# Altium schematic sheet Lab7-8_CH4.SchDoc
size B; DrawnBy: Aaron Huinink; SheetNumber: 5; SheetTotal: 5
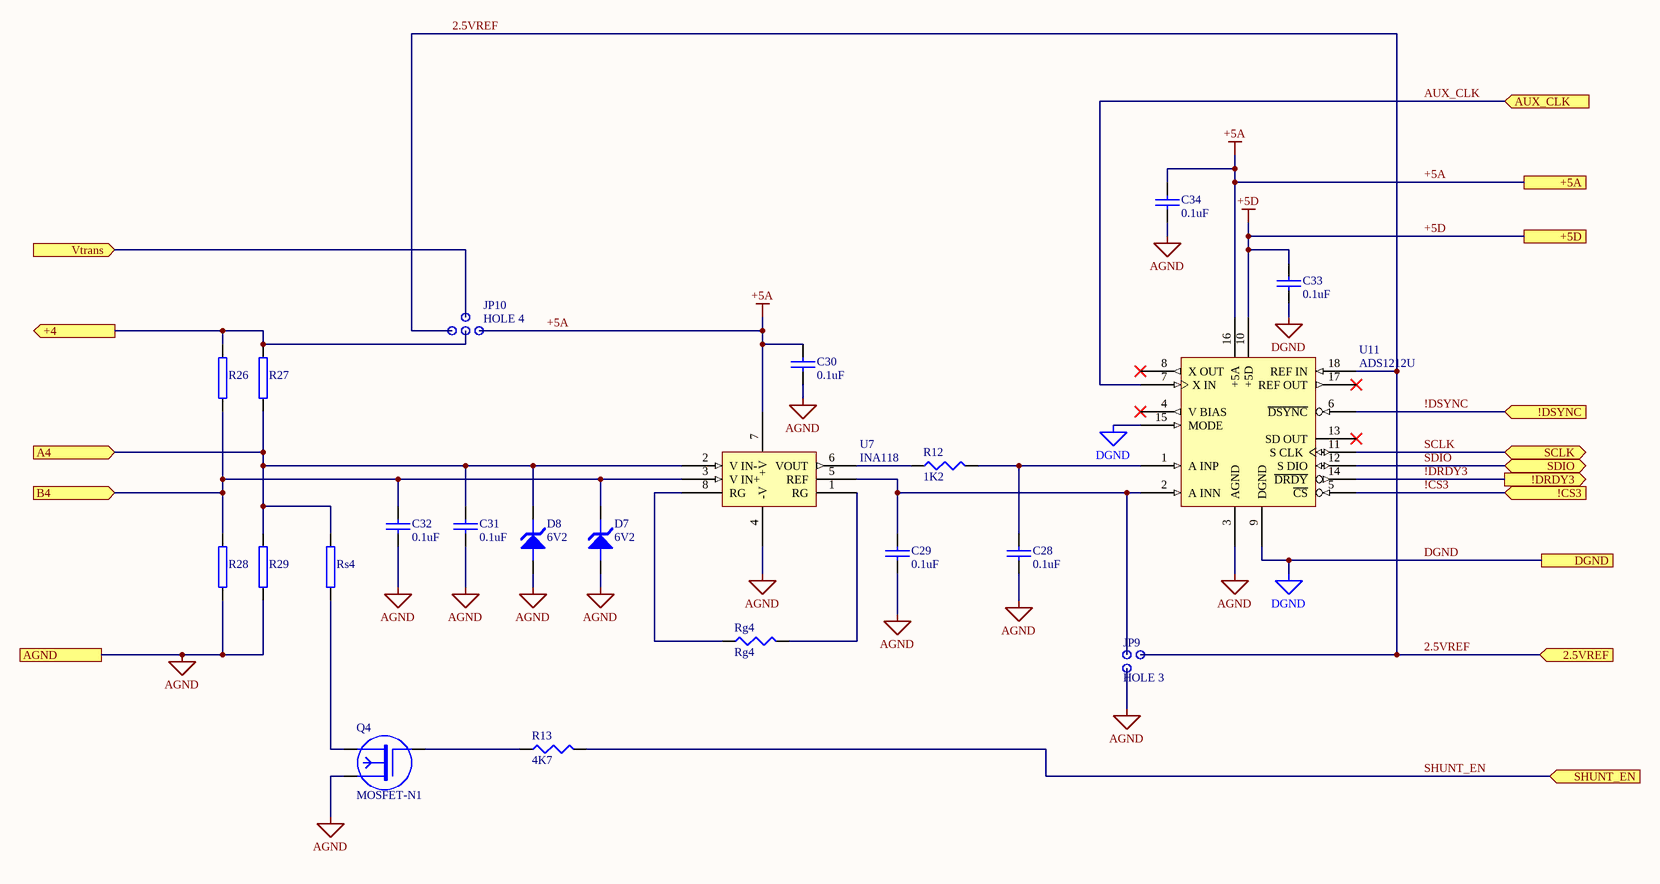
[diagram p0: Lab7-8_CH4.SchDoc]

## Parts
C28  0.1uF  [0805]
C29  0.1uF  [0805]
C30  0.1uF  [0805]
C31  0.1uF  [0805]
C32  0.1uF  [0805]
C33  0.1uF  [0805]
C34  0.1uF  [0805]
D7  6V2  [SOD-123]
D8  6V2  [SOD-123]
JP9  HOLE 3  [RAD0.1A]
JP10  HOLE 4  [RAD0.1B]
Q4  MOSFET-N1  [SOT-23]
R12  1K2  [0805]
R13  4K7  [0805]
R26  bridge R  [bridge resistor]  (value not drawn)
R27  bridge R  [bridge resistor]  (value not drawn)
R28  bridge R  [bridge resistor]  (value not drawn)
R29  bridge R  [bridge resistor]  (value not drawn)
Rg4  Rg4  [0805]
Rs4  bridge R  [bridge resistor]  (value not drawn)
U7  INA118  [SO-8]
U11  ADS1212U  [SOIC18]

## Ports
2.5VREF (in, see Lab7-8_TOP[4A], Lab7-8_CH1[5C], Lab7-8_CH2[6C], Lab7-8_CH3[6C]), !CS3 (in, see Lab7-8_TOP[4A]), !DRDY3 (out, see Lab7-8_TOP[4A]), !DSYNC (in, see Lab7-8_TOP[4A], Lab7-8_CH1[5B], Lab7-8_CH2[5B], Lab7-8_CH3[6B]), +4 (out, see Lab7-8_TOP[3A]), +5A (see Lab7-8_TOP[4A], Lab7-8_CH1[5B], Lab7-8_CH2[6B], Lab7-8_CH3[6B]), +5D (see Lab7-8_TOP[4A], Lab7-8_CH1[5B], Lab7-8_CH2[6B], Lab7-8_CH3[6B]), A4 (in, see Lab7-8_TOP[3A]), AGND (see Lab7-8_TOP[3A], Lab7-8_CH1[1C], Lab7-8_CH2[1C], Lab7-8_CH3[1C]), AUX_CLK (in, see Lab7-8_TOP[4A], Lab7-8_CH1[5A], Lab7-8_CH2[5A], Lab7-8_CH3[6A]), B4 (in, see Lab7-8_TOP[3A]), DGND (see Lab7-8_TOP[4A], Lab7-8_CH1[5C], Lab7-8_CH2[6C], Lab7-8_CH3[6C]), SCLK (bidir, see Lab7-8_TOP[4A], Lab7-8_CH1[5B], Lab7-8_CH2[5B], Lab7-8_CH3[6B]), SDIO (bidir, see Lab7-8_TOP[4A], Lab7-8_CH1[5B], Lab7-8_CH2[5B], Lab7-8_CH3[6B]), SHUNT_EN (in, see Lab7-8_TOP[4A], Lab7-8_CH1[5C], Lab7-8_CH2[6C], Lab7-8_CH3[6C]), Vtrans (in, see Lab7-8_TOP[3A])

## Nets
+5A: C30.1 C34.1 JP10.1 U7.7(+V) U11.16(+5A) ; port +5A  [also labelled +V]
+5D: C33.1 U11.10(+5D) ; port +5D
-V: C28.2 C29.2 C30.2 C31.2 C32.2 C34.2 D7.A D8.A JP9.1 Q4.2 R28.1 R29.1 U7.4(-V) U11.3(AGND) ; port AGND  [also labelled AGND]
DGND: C33.2 U11.9(DGND) U11.15(MODE) ; port DGND
2.5VREF: JP9.3 JP10.4 U11.18(REF_IN) ; port 2.5VREF
!CS3: U11.5(~{CS}) ; port !CS3
!DRDY3: U11.14(~{DRDY}) ; port !DRDY3
!DSYNC: U11.6(~{DSYNC}) ; port !DSYNC
+4: JP10.2 R26.2 R27.2 ; port +4
A4: C31.1 D8.K R27.1 R29.2 Rs4.2 U7.2(V_IN-) ; port A4
AUX_CLK: U11.7(X_IN) ; port AUX_CLK
B4: C32.1 D7.K R26.1 R28.2 U7.3(V_IN+) ; port B4
SCLK: U11.11(S_CLK) ; port SCLK
SDIO: U11.12(S_DIO) ; port SDIO
SHUNT_EN: R13.2 ; port SHUNT_EN
Vtrans: JP10.3 ; port Vtrans
NetC28_1: C28.1 R12.2 U11.1(A_INP)
NetC29_1: C29.1 JP9.2 U7.5(REF) U11.2(A_INN)
NetQ4_1: Q4.1 R13.1
NetQ4_3: Q4.3 Rs4.1
NetR12_1: R12.1 U7.6(VOUT)
NetRg4_1: Rg4.1 U7.8(RG)
NetRg4_2: Rg4.2 U7.1(RG)

Not connected (* = marked no-connect by the designer): U11 4(V_BIAS)* 8(X_OUT)* 13(SD_OUT)* 17(REF_OUT)*

## Notes on the sheet
- Title
- Size:
- Date:
- A
- Number:
- Time:
- Revision:
- Sheet
- of
- File:

## Library data of the parts
C28-C34 = CAP
D7 D8 = ZENER3
R12 R13 Rg4 = RES1
R26-R29 Rs4 = RES2
U7 = INA118: Precision, Low Power Instrumentation Amplifier
U11 = ADS1212U(18): 22-Bit Analog-to-Digital Converter